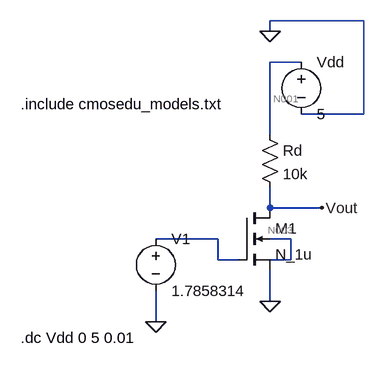
[diagram p0: schematic Parte4.asc]
Parte4.asc, the LTspice schematic file:
Version 4
SHEET 1 880 680
WIRE 288 -160 144 -160
WIRE 144 -144 144 -160
WIRE 192 -96 144 -96
WIRE 288 -16 288 -160
WIRE 288 -16 192 -16
WIRE 144 16 144 -96
WIRE 144 128 144 96
WIRE 224 128 144 128
WIRE 64 176 -32 176
WIRE 176 176 144 176
WIRE 64 208 64 176
WIRE 96 208 64 208
WIRE 176 208 176 176
WIRE 176 208 144 208
WIRE 144 272 144 224
WIRE -32 304 -32 256
FLAG -32 304 0
FLAG 144 272 0
FLAG 144 -144 0
FLAG 224 128 Vout
SYMBOL nmos4 96 128 R0
SYMATTR InstName M1
SYMATTR Value N_1u
SYMATTR Value2 l=1.5u w=9.23u
SYMBOL res 128 0 R0
SYMATTR InstName Rd
SYMATTR Value 10k
SYMBOL voltage 192 -112 R0
WINDOW 123 0 0 Left 2
WINDOW 39 0 0 Left 2
SYMATTR InstName Vdd
SYMATTR Value 5
SYMBOL voltage -32 160 R0
SYMATTR InstName V1
SYMATTR Value 1.7858314
TEXT -240 -32 Left 2 !.include cmosedu_models.txt
TEXT -240 328 Left 2 !.dc Vdd 0 5 0.01

The netlist it stands for:
* Parte4.asc
M1 Vout N002 0 N003 N_1u l=1.5u w=9.23u
Rd N001 Vout 10k
Vdd N001 0 5
V1 N002 0 1.7858314
.model NMOS NMOS
.model PMOS PMOS
.lib standard.mos
.include cmosedu_models.txt
.dc Vdd 0 5 0.01
.backanno
.end

* Results of the author's LTspice run, read from the files saved beside the schematic
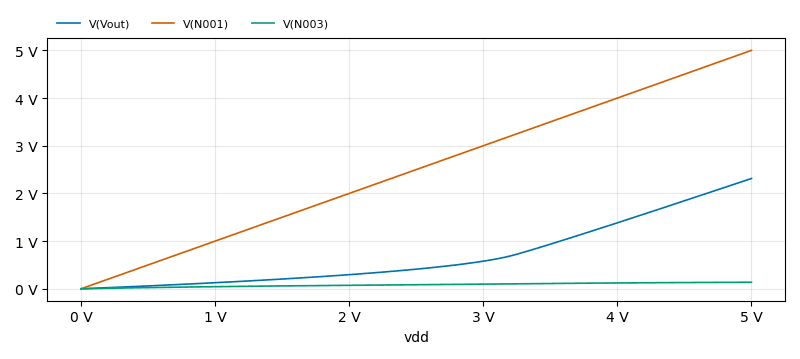
[diagram p1: DC transfer characteristic of Parte4.asc, plotted from the saved traces]
* DC transfer characteristic, 1 run:
*   V(Vout): -0.001996 fV at vdd=0 V, 2.313 V at vdd=5 V, min -0.001996 fV, max 2.313 V
*   V(N001): 0 V at vdd=0 V, 5 V at vdd=5 V, min 0 V, max 5 V
*   V(N003): 70.98 fV at vdd=0 V, 137.8 mV at vdd=5 V, min 70.98 fV, max 137.8 mV